# Altium schematic sheet CPU MISC.SchDoc: CPU MISC
size A3; DrawnBy: UKAYACIK; Engineer: UKAYACIK; DocumentNumber: 6; Revision: B; SheetNumber: 7; SheetTotal: 21
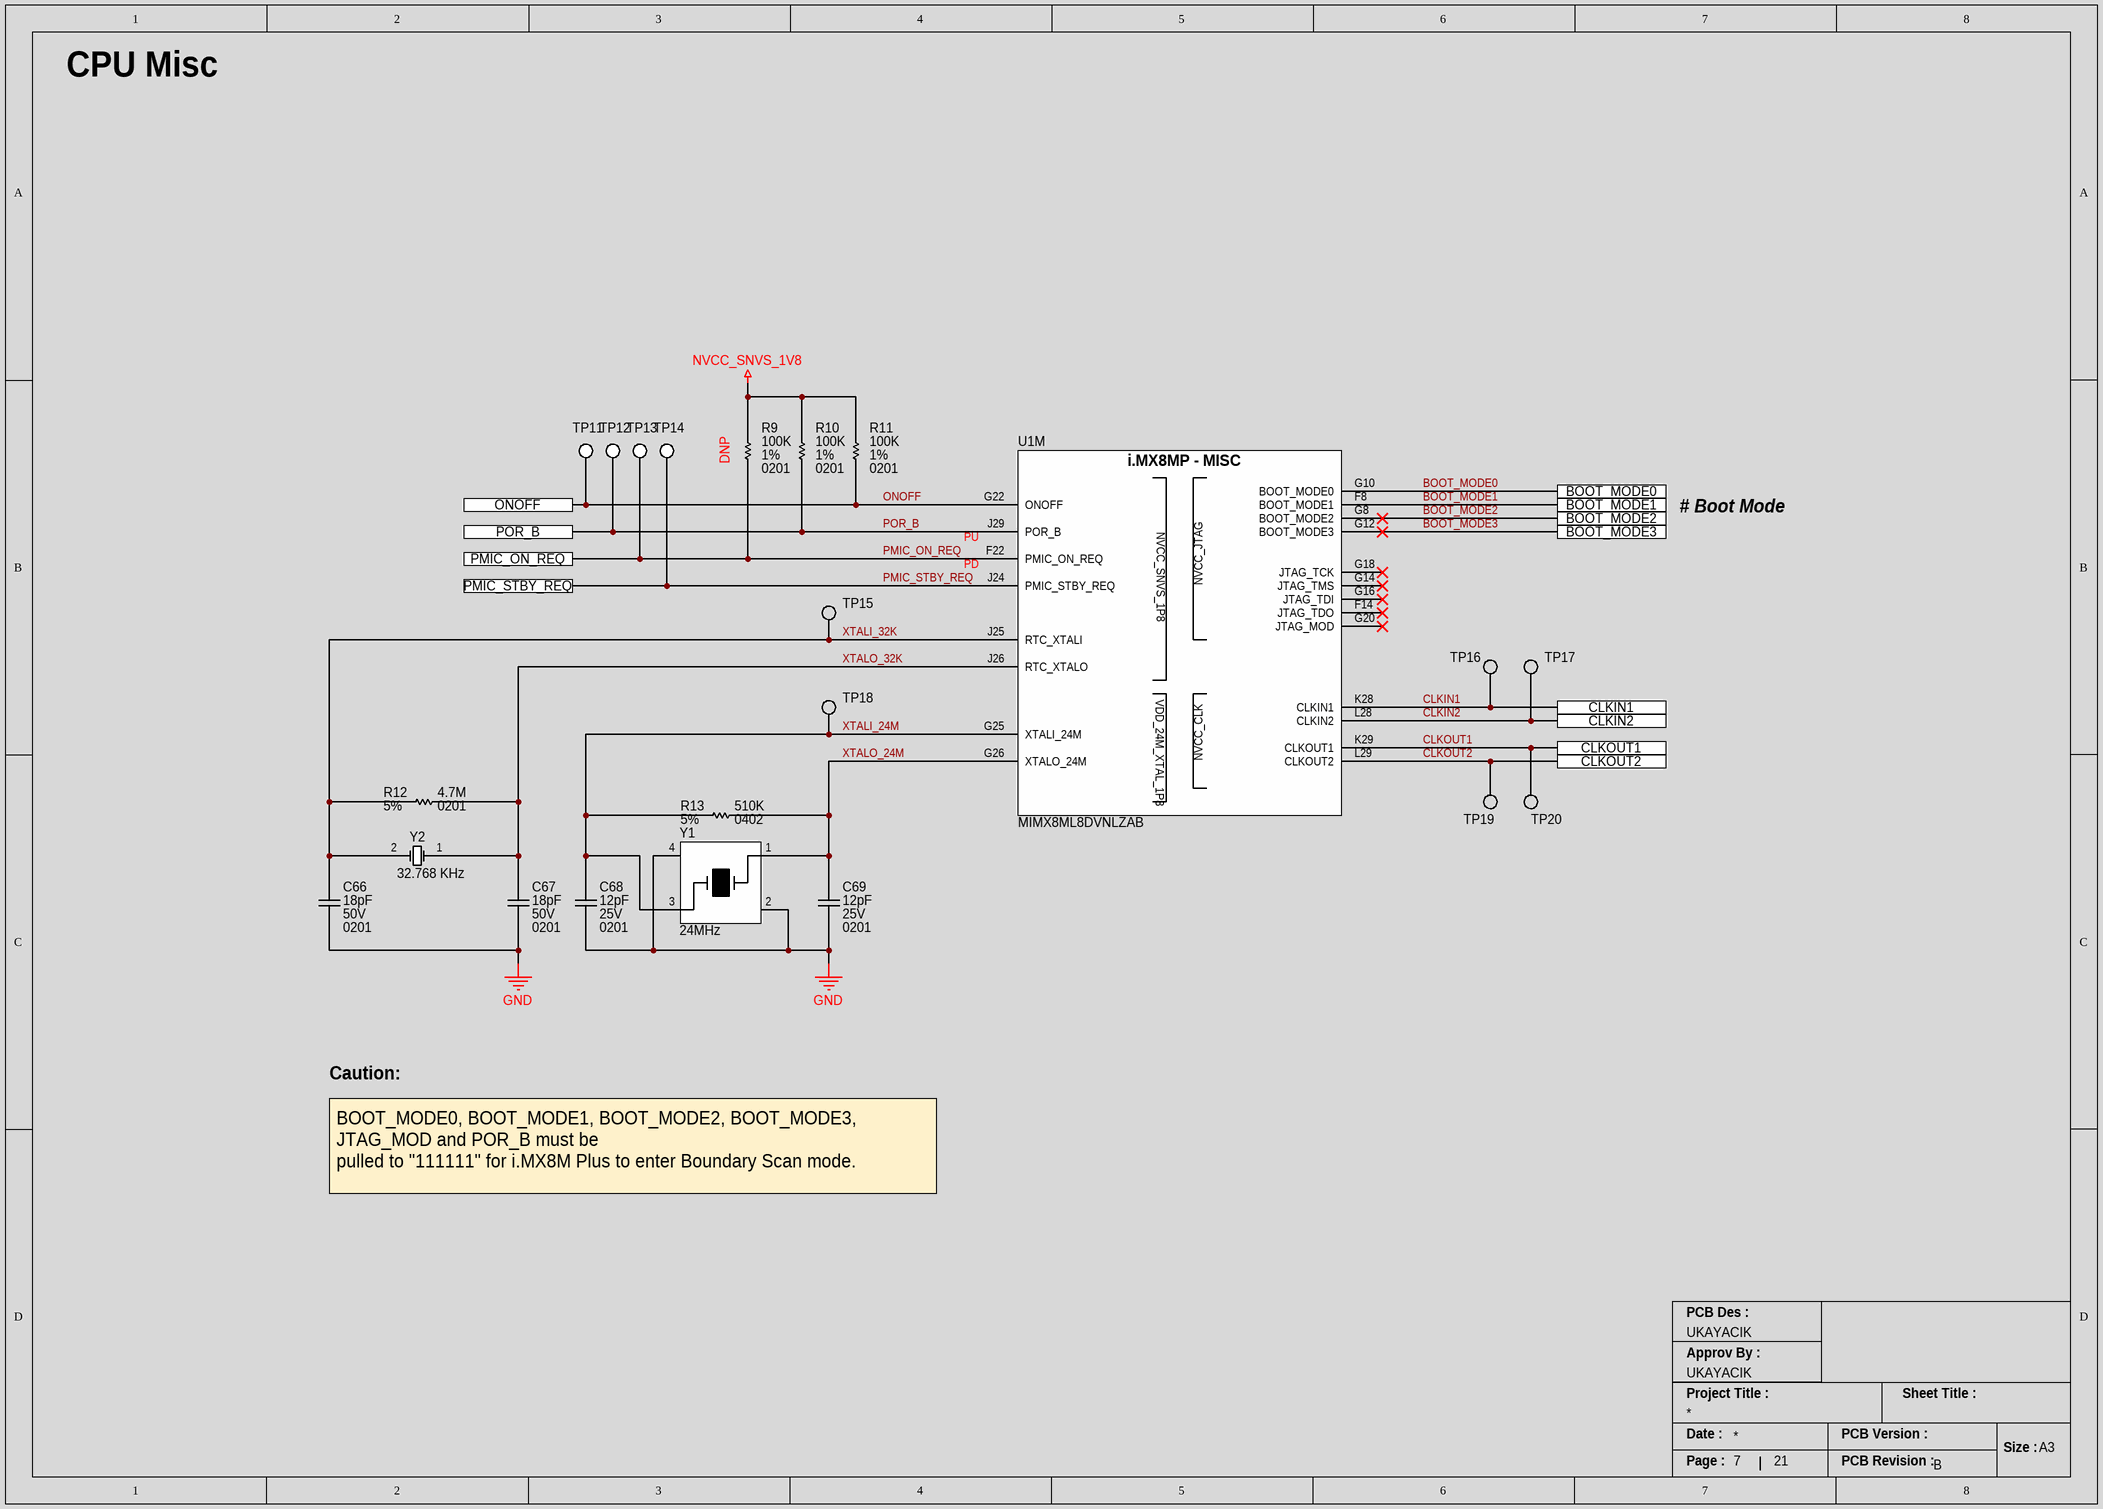
[diagram p0: CPU MISC.SchDoc]

## Parts
C66  Capacitance: 18pF  Voltage Rating: 50V  Case/Package: 0201  [CAP_0201_CAPC0603X03N]  (hidden comment: GRM0335C1H180JA01D)
C67  Capacitance: 18pF  Voltage Rating: 50V  Case/Package: 0201  [CAP_0201_CAPC0603X03N]  (hidden comment: GRM0335C1H180JA01D)
C68  Voltage Rating: 25V  Capacitance: 12pF  Case/Package: 0201  [CAP_0201_CAPC0603X03N]  (hidden comment: CGA1A2C0G1E120J030BA)
C69  Voltage Rating: 25V  Capacitance: 12pF  Case/Package: 0201  [CAP_0201_CAPC0603X03N]  (hidden comment: CGA1A2C0G1E120J030BA)
R9  Resistance: 100K  Tolerance: 1%  Case/Package: 0201  [RES_0201_RESC0603X02N]  (hidden comment: RC0201FR-07100KL)
R10  Resistance: 100K  Tolerance: 1%  Case/Package: 0201  [RES_0201_RESC0603X02N]  (hidden comment: RC0201FR-07100KL)
R11  Resistance: 100K  Tolerance: 1%  Case/Package: 0201  [RES_0201_RESC0603X02N]  (hidden comment: RC0201FR-07100KL)
R12  Tolerance: 5%  Resistance: 4.7M  Case/Package: 0201  [RES_0201_RESC0603X02N]  (hidden comment: RC0201JR-074M7L)
R13  Tolerance: 5%  Resistance: 510K  Case/Package: 0402  [RES_0402_RESC1005X04N]  (hidden comment: ERJ-2GEJ514X)
TP11  NO COMPONENT  [TP_PAD_0.8MM_SMD_ROUND]  (value not drawn)  (no BOM)
TP12  NO COMPONENT  [TP_PAD_0.8MM_SMD_ROUND]  (value not drawn)  (no BOM)
TP13  NO COMPONENT  [TP_PAD_0.8MM_SMD_ROUND]  (value not drawn)  (no BOM)
TP14  NO COMPONENT  [TP_PAD_0.8MM_SMD_ROUND]  (value not drawn)  (no BOM)
TP15  NO COMPONENT  [TP_PAD_0.5MM_SMD_ROUND]  (value not drawn)  (no BOM)
TP16  NO COMPONENT  [TP_PAD_0.5MM_SMD_ROUND]  (value not drawn)  (no BOM)
TP17  NO COMPONENT  [TP_PAD_0.5MM_SMD_ROUND]  (value not drawn)  (no BOM)
TP18  NO COMPONENT  [TP_PAD_0.5MM_SMD_ROUND]  (value not drawn)  (no BOM)
TP19  NO COMPONENT  [TP_PAD_0.5MM_SMD_ROUND]  (value not drawn)  (no BOM)
TP20  NO COMPONENT  [TP_PAD_0.5MM_SMD_ROUND]  (value not drawn)  (no BOM)
U1  MIMX8ML8DVNLZAB  [IC_MPU_BGA548C50P29X29_1500X1500X148]  (part M of 15)
Y1  Frequency: 24MHz  [CRYSTAL_24MHz_OSCCC320X250X60]  (hidden comment: TSX-3225 24.0000MF15X-AC3)
Y2  Operating Frequency: 32.768 KHz  [CRYSTAL_ABS07-32.768KHZ-T]  (hidden comment: ABS07-32.768KHZ-T)

## Ports
BOOT_MODE0, BOOT_MODE1, BOOT_MODE2, BOOT_MODE3, CLKIN1, CLKIN2, CLKOUT1, CLKOUT2, ONOFF, PMIC_ON_REQ, PMIC_STBY_REQ, POR_B

## Nets
GND: C66.1 C67.1 C68.1 C69.1 Y1.2 Y1.4
NVCC_SNVS_1V8: R9.2 R10.2 R11.2
BOOT_MODE0: U1.G10(BOOT_MODE0) ; port BOOT_MODE0
BOOT_MODE1: U1.F8(BOOT_MODE1) ; port BOOT_MODE1
BOOT_MODE2: U1.G8(BOOT_MODE2) ; port BOOT_MODE2
BOOT_MODE3: U1.G12(BOOT_MODE3) ; port BOOT_MODE3
CLKIN1: TP16.1 U1.K28(CLKIN1) ; port CLKIN1
CLKIN2: TP17.1 U1.L28(CLKIN2) ; port CLKIN2
CLKOUT1: TP20.1 U1.K29(CLKOUT1) ; port CLKOUT1
CLKOUT2: TP19.1 U1.L29(CLKOUT2) ; port CLKOUT2
ONOFF: R11.1 TP11.1 U1.G22(ONOFF) ; port ONOFF
PMIC_ON_REQ: R9.1 TP13.1 U1.F22(PMIC_ON_REQ) ; port PMIC_ON_REQ
PMIC_STBY_REQ: TP14.1 U1.J24(PMIC_STBY_REQ) ; port PMIC_STBY_REQ
POR_B: R10.1 TP12.1 U1.J29(POR_B) ; port POR_B
XTALI_24M: C68.2 R13.1 TP18.1 U1.G25(XTALI_24M) Y1.3
XTALI_32K: C66.2 R12.1 TP15.1 U1.J25(RTC_XTALI) Y2.2(OSC2)
XTALO_24M: C69.2 R13.2 U1.G26(XTALO_24M) Y1.1
XTALO_32K: C67.2 R12.2 U1.J26(RTC_XTALO) Y2.1(OSC1)

Not connected (* = marked no-connect by the designer): U1 F14(JTAG_TDO)* G14(JTAG_TMS)* G16(JTAG_TDI)* G18(JTAG_TCK)* G20(JTAG_MOD)*

## Notes on the sheet
- CPU Misc
- (near R9) DNP
- # Boot Mode
- (near U1) PD
- (near U1) PU
- Caution:
- BOOT_MODE0, BOOT_MODE1, BOOT_MODE2, BOOT_MODE3, JTAG_MOD and POR_B must be
  pulled to "111111" for i.MX8M Plus to enter Boundary Scan mode.
- PCB Des :
- Approv By :
- Project Title :
- Sheet Title :
- Date :
- PCB Version :
- Size :
- A3
- Page :
- PCB Revision :
- (in symbol IC_MPU_8M_PLUS_MIMX8ML8DVNLZAB, part M) i.MX8MP - MISC

## Library data of the parts
C66 C67 = CAP_18PF_50V_NP0_0201: Multilayer Ceramic Capacitor, 18 pF, 50 V, ± 5%, C0G (NP0), 0201 [0603 Metric]; Manufacturer: Murata; Temperature Coefficient: 30ppm/°C; Supplier 1: Digikey; Manufacturer Part Number: GRM0335C1H180JA01D; RoHS: Yes; Category: Ceramic Capacitors; Stock 1: 464126; Pricing 1: 1=0.1, 10=0.011, 50=0.0062, 100=0.0048, 500=0.0036, 1000=0.00283, 2500=0.00258, 5000=0.00237 (USD); Mount: Surface Mount; Case Code (Metric): 0603; Case Code (Imperial): 0201; Material: Ceramic; Min Operating Temperature: -55°C; Max Operating Temperature: 125°C; Package Quantity: 15000; Packaging: Tape and Reel; Voltage Rating (DC): 50V; Termination: SMD/SMT; Series: GRM; Dielectric: C0G; Tolerance: 5%; Voltage: 50V; Length: 0.6mm; Width: 0.3mm; Height: 0.3mm; Depth: 0.3mm; Radiation Hardening: No; RoHS Compliant: Yes; Lead Free: Lead Free; Supplier Part Number 1: 490-6117-1-ND
C68 C69 = CAP_12PF_25V_NP0_0201: CAPACITORS CERAMIC, 12PF, 5%, 25V, C0G, 0201[0603]; Product Range: TDK - CGA Seri; Supplier 1: Mouser; Manufacturer: TDK; Manufacturer Part Number: CGA1A2C0G1E120J030BA; RoHS: Yes; Category: Ceramic Capacitors; Stock 1: 58112; Pricing 1: 1=0.1, 10=0.041, 50=0.041, 100=0.024, 1000=0.017, 10000=0.014 (USD); Mount: Surface Mount; Case Code (Metric): 0603; Case Code (Imperial): 0201; Weight: 6E-06oz; Min Operating Temperature: -55°C; Max Operating Temperature: 125°C; Tolerance: 5%; Packaging: Tape and Reel; Termination: SMD/SMT; Series: CGA; Package Quantity: 15000; Voltage Rating (DC): 25V; Dielectric: C0G; Length: 0.6mm; Width: 0.3mm; Height: 0.3mm; Depth: 0.3mm; Ratings: AEC-Q200; RoHS Compliant: Yes; ComponentLink1URL: https://datasheet.ciiva.com/24221/cga1a2c0g1e120j030ba-271847-24221437.pdf?src-supplier=Mouser; ComponentLink1Description: https://datasheet.ciiva.com/24221/cga1a2c0g1e120j030ba-271847-24221437.pdf?src-supplier=Mouser; Supplier Part Number 1: 810-CGA1A2C0G1E120J
R9-R11 = RES_100K_1%_50mW_0201: SMD Chip Resistor, 100 kOhm, ± 1%, 50 mW, 0201 [0603 Metric], Thick Film, General Purpose; Manufacturer: Yageo; Temperature Coefficient: 200ppm/°C; Power Rating: 50mW; Voltage Rating: 25V; Supplier 1: Digikey; Manufacturer Part Number: RC0201FR-07100KL; RoHS: Yes; Category: Chip SMD Resistors; Stock 1: 2564699; Pricing 1: 1=0.1, 10=0.027, 50=0.0172, 100=0.0143, 500=0.00988, 1000=0.00854, 5000=0.00629 (USD); Number of Pins: 2NUMBER; Contact Plating: Tin,Matte; Case Code (Imperial): 0201; Case Code (Metric): 0603; Size Code: 0201; Min Operating Temperature: -55°C; Max Operating Temperature: 125°C; Resistor Type: Thick Film; Packaging: Tape and Reel; Package Quantity: 10000; Termination: SMD/SMT; Number of Terminations: 2; Max Power Dissipation: 50mW; Features: Moisture Resistant; Series: RC; Resistance Tolerance: 1%; Construction: Rectangular; Voltage Rating (DC): 25V; Length: 0.024inch; Width: 0.012inch; Height: 0.01inch; Depth: 0.3mm; Reach SVHC Compliant: No; Military Standard: Not; RoHS Compliant: Yes; Lead Free: 5697LeadFree; ComponentLink1URL: https://datasheet.ciiva.com/2493/pyu-r-int-thick-7-2493769.pdf?src-supplier=Digikey; ComponentLink1Description: https://datasheet.ciiva.com/2493/pyu-r-int-thick-7-2493769.pdf?src-supplier=Digikey; ComponentLink2URL: https://datasheet.ciiva.com/2493/pyu-r-int-thick-7-2493770.pdf?src-supplier=Digikey; ComponentLink2Description: https://datasheet.ciiva.com/2493/pyu-r-int-thick-7-2493770.pdf?src-supplier=Digikey; ComponentLink3URL: https://datasheet.ciiva.com/2493/pyu-r-int-thick-7-2493771.pdf?src-supplier=Digikey; ComponentLink3Description: https://datasheet.ciiva.com/2493/pyu-r-int-thick-7-2493771.pdf?src-supplier=Digikey; ComponentLink4URL: https://datasheet.ciiva.com/26829/getdatasheetpartid-420441-26829850.pdf?src-supplier=Verical; ComponentLink4Description: https://datasheet.ciiva.com/26829/getdatasheetpartid-420441-26829850.pdf?src-supplier=Verical; ComponentLink5URL: https://datasheet.ciiva.com/22698/1563626-22698495.pdf?src-supplier=Element14; ComponentLink5Description: https://datasheet.ciiva.com/22698/1563626-22698495.pdf?src-supplier=Element14; ComponentLink6URL: https://datasheet.ciiva.com/7660/1421516-7660806.pdf?src-supplier=Element14; ComponentLink6Description: https://datasheet.ciiva.com/7660/1421516-7660806.pdf?src-supplier=Element14; ComponentLink7URL: https://datasheet.ciiva.com/46391/1421516-46391338.pdf?src-supplier=Element14; ComponentLink7Description: https://datasheet.ciiva.com/46391/1421516-46391338.pdf?src-supplier=Element14; Supplier Part Number 1: 311-100KMDKR-ND
R12 = RES_4.7M_5%_50mW_0201: SMD Chip Resistor, 4.7 MOhm, ± 5%, 50 mW, 0201 [0603 Metric], Thick Film, General Purpose; Manufacturer: Yageo; Max Power Dissipation: 50mW; Temperature Coefficient: 200ppm/°C; Supplier 1: Digikey; Manufacturer Part Number: RC0201JR-074M7L; RoHS: Yes; Category: Chip SMD Resistors; Stock 1: 74834; Pricing 1: 1=0.1, 10=0.021, 50=0.0132, 100=0.011, 500=0.00746, 1000=0.00643, 5000=0.00468 (USD); Case Code (Metric): 0603; Case Code (Imperial): 0201; Min Operating Temperature: -55°C; Max Operating Temperature: 125°C; Packaging: Cut Tape; Number of Terminations: 2; Features: Moisture Resistant; Series: RC; RoHS Compliant: Yes; ComponentLink1URL: http://www.yageo.com/documents/recent/PYu-RC_Group_51_RoHS_L_9.pdf?src-supplier=Digikey; ComponentLink1Description: http://www.yageo.com/documents/recent/PYu-RC_Group_51_RoHS_L_9.pdf?src-supplier=Digikey; ComponentLink2URL: https://www.yageo.com/upload/media/product/productsearch/datasheet/rchip/PYu-RC_Group_51_RoHS_L_11.pdf?src-supplier=Digikey; ComponentLink2Description: https://www.yageo.com/upload/media/product/productsearch/datasheet/rchip/PYu-RC_Group_51_RoHS_L_11.pdf?src-supplier=Digikey; ComponentLink3URL: https://datasheet.octopart.com/RC0201JR-074M7L-Yageo-datasheet-164759695.pdf?src-supplier=Future+Electronics; ComponentLink3Description: https://datasheet.octopart.com/RC0201JR-074M7L-Yageo-datasheet-164759695.pdf?src-supplier=Future+Electronics; Supplier Part Number 1: YAG2904CT-ND
R13 = RES_510K_5%_100mW_0402: SMD Chip Resistor, 510 kOhm, ± 5%, 100 mW, 0402 [1005 Metric], Thick Film, General Purpose; Manufacturer: Panasonic; Power Rating: 100mW; Voltage Rating: 50V; Temperature Coefficient: 200ppm/°C; Supplier 1: Digikey; Manufacturer Part Number: ERJ-2GEJ514X; RoHS: Yes; Category: Chip SMD Resistors; Stock 1: 171465; Pricing 1: 1=0.1, 10=0.022, 50=0.0134, 100=0.0112, 500=0.00758, 1000=0.00651, 5000=0.00473 (USD); Mount: Surface Mount; Case Code (Imperial): 0402; Case Code (Metric): 1005; Weight: 2.8E-05oz; Contact Plating: Tin; Min Operating Temperature: -55°C; Max Operating Temperature: 155°C; Packaging: Tape and Reel; Package Quantity: 10000; Resistor Type: Thick Film; Number of Terminations: 2; Max Power Dissipation: 100mW; Voltage Rating (DC): 50V; Features: Automotive AEC-Q200; Series: ERJ; Resistance Tolerance: 5%; Termination: SMD/SMT; Construction: Rectangular; Technology: THICK FILM; Length: 1mm; Width: 0.5mm; Height: 0.35mm; Depth: 0.5mm; Ratings: AEC-Q200; Radiation Hardening: No; Reach SVHC Compliant: No; Lead Free: Lead Free; RoHS Compliant: Yes; Military Standard: Not; ComponentLink1URL: https://datasheet.ciiva.com/11821/0900766b80f806dd-11821324.pdf?src-supplier=Rs; ComponentLink1Description: https://datasheet.ciiva.com/11821/0900766b80f806dd-11821324.pdf?src-supplier=Rs; ComponentLink2URL: https://datasheet.ciiva.com/30121/4aoa0000ce1-30121622.pdf?src-supplier=Onlinecomponents.com; ComponentLink2Description: https://datasheet.ciiva.com/30121/4aoa0000ce1-30121622.pdf?src-supplier=Onlinecomponents.com; ComponentLink3URL: https://datasheet.ciiva.com/8079/1678796-8079437.pdf?src-supplier=Element14; ComponentLink3Description: https://datasheet.ciiva.com/8079/1678796-8079437.pdf?src-supplier=Element14; Supplier Part Number 1: P510KJCT-ND
TP11-TP14 = TP_PAD_SMD_Round: Test Point, SMD pad, round, 1.5mm, 1.6mm, 3mm diameter
TP15-TP20 = TP_PAD_SMD_SMALL: Test Point, SMD pad, round, 1.5mm, 1.6mm, 3mm diameter
U1 = IC_MPU_8M_PLUS_MIMX8ML8DVNLZAB: i.MX 8M Plus, Consumer, / TRAY TRAY MULTIPLE DP BAKEABLE RoHS Compliant: Yes; Manufacturer: NXP Semiconductors; Supplier 1: Arrow Electronics; Manufacturer Part Number: MIMX8ML8DVNLZAB; RoHS: Yes; Category: Microprocessors; Stock 1: 1036; Pricing 1: 1=54.8, 5=52.24, 10=44.19, 25=42.8, 50=39.95, 100=31.83 (USD); Supplier Part Number 1: MIMX8ML8DVNLZAB
Y1 = CRYSTAL_EPSON_24MHz_TSX-3225 24.0000MF15X-AC3: 24 MHz ±10ppm Crystal 9pF 40 Ohms 4-SMD, No Lead; Manufacturer: Epson; Supplier 1: Digi-Key; Manufacturer Part Number: TSX-3225 24.0000MF15X-AC3; RoHS: Yes; Category: Crystals; Mount: Surface Mount; Case/Package: SMD/SMT; Min Operating Temperature: -40°C; Max Operating Temperature: 85°C; Load Capacitance: 9pF; Frequency Tolerance: 10ppm; Series: FC-135; RoHS Compliant: Yes
Y2 = CRYSTAL_ABRACON_32.768KHz_ABS07-32.768KHZ-T: Crystal 0.032768MHz ±20ppm (Tol) 12.5pF Flexural 70000Ohm 2-Pin CSMD T/R; ESR (Equivalent Series Resistance): 70kR; Supplier 1: Digikey; Manufacturer: Abracon; Manufacturer Part Number: ABS07-32.768KHZ-T; RoHS: Yes; Category: Crystals; Stock 1: 1583168; Pricing 1: 1=0.69, 10=0.576, 50=0.5184, 100=0.4607, 500=0.43768, 1000=0.36858 (USD); Case/Package: CSMD; Number of Pins: 2; Min Operating Temperature: -40°C; Max Operating Temperature: 85°C; Frequency Tolerance: 20ppm; Load Capacitance: 12.5pF; Frequency: 32.768kHz; Packaging: Tape and Reel; Series: ABS07; Package Quantity: 3000; Tolerance: 20ppm; Termination: SMD/SMT; Series Resistance: 70kR; Length: 3.2mm; Width: 1.5mm; Height: 0.9mm; Depth: 1.5mm; Radiation Hardening: No; RoHS Compliant: Yes; Lead Free: Lead Free; Reach SVHC Compliant: No; ComponentLink1URL: https://datasheet.ciiva.com/7998/1912628-7998667.pdf?src-supplier=Element14; ComponentLink1Description: https://datasheet.ciiva.com/7998/1912628-7998667.pdf?src-supplier=Element14; ComponentLink2URL: https://datasheet.ciiva.com/1357/1883680-1357319.pdf?src-supplier=Element14; ComponentLink2Description: https://datasheet.ciiva.com/1357/1883680-1357319.pdf?src-supplier=Element14; ComponentLink3URL: https://datasheet.ciiva.com/854/abs07-854936.pdf?src-supplier=Digikey; ComponentLink3Description: https://datasheet.ciiva.com/854/abs07-854936.pdf?src-supplier=Digikey; ComponentLink4URL: https://datasheet.ciiva.com/854/abs07-854935.pdf?src-supplier=Digikey; ComponentLink4Description: https://datasheet.ciiva.com/854/abs07-854935.pdf?src-supplier=Digikey; ComponentLink5URL: https://datasheet.ciiva.com/854/abs07-854937.pdf?src-supplier=Digikey; ComponentLink5Description: https://datasheet.ciiva.com/854/abs07-854937.pdf?src-supplier=Digikey; ComponentLink6URL: https://datasheet.ciiva.com/4944/abs07-11028-4944830.pdf?src-supplier=Mouser; ComponentLink6Description: https://datasheet.ciiva.com/4944/abs07-11028-4944830.pdf?src-supplier=Mouser; Supplier Part Number 1: 535-9542-1-ND